# EAGLE design snowflake (EAGLE 7.4.0)
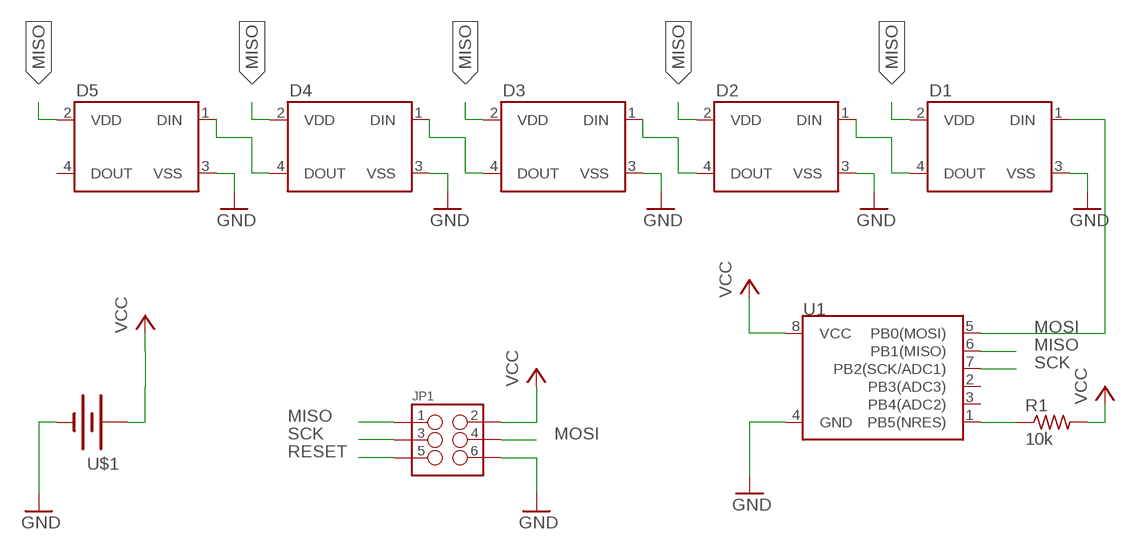
[diagram p0: schematic, sheet 1]

## Parts
D1  WS2812BEDGE_MOUNT_5MM_LED  [WS2812B]
D2  WS2812BEDGE_MOUNT_5MM_LED  [WS2812B]
D3  WS2812BEDGE_MOUNT_5MM_LED  [WS2812B]
D4  WS2812BEDGE_MOUNT_5MM_LED  [WS2812B]
D5  WS2812BEDGE_MOUNT_5MM_LED  [WS2812B]
JP1  M03X2POGO_PINS  [2X3_POGO]
R1  10k  R-US_R0805  [R0805]
U1  ATTINY45TINY85-20-SMT  [SO08-EIAJ]
U$1  BATTERY  [BHX2-2032-SM]

## Nets
GND: D1.3(VSS) D2.3(VSS) D3.3(VSS) D4.3(VSS) D5.3(VSS) JP1.P$6 U1.4(GND) U$1.GND(-)
MISO: D1.2(VDD) D2.2(VDD) D3.2(VDD) D4.2(VDD) D5.2(VDD) JP1.P$1 U1.6(PB1(MISO))
MOSI: D1.1(DIN) JP1.P$4 U1.5(PB0(MOSI))
N$2: D1.4(DOUT) D2.1(DIN)
N$3: D2.4(DOUT) D3.1(DIN)
N$4: D3.4(DOUT) D4.1(DIN)
N$5: D4.4(DOUT) D5.1(DIN)
RESET: JP1.P$5 R1.1 U1.1(PB5(NRES))
SCK: JP1.P$3 U1.7(PB2(SCK/ADC1))
VCC: JP1.P$2 R1.2 U1.8(VCC) U$1.VCC(+) U$1.VCC-2(+)
Unconnected: D5.4(DOUT) U1.2(PB3(ADC3)) U1.3(PB4(ADC2))

## Library data of the parts
D1-D5 = my-custom-lib:WS2812B: WS2812B - Intelligent control LED integrated light source Technical Specifications: Power Supply Voltage (VDD): 3.5 to 5.3 V Input Voltage (VI): -0.5 to VDD+0.5 V Operating Junction Temperature (Topt): -25°C to +80°C Storage Temperature Range (Tstg): -55°C to +150°C
JP1 = SparkFun-Connectors:M03X2: 2x3 .1" header. Shrouded, with keying- CONN-10681 SMT- CONN-11415 Pogo pins- HW-11044; PROD_ID: HW-11044
R1 = resistor:R-US_: RESISTOR, American symbol
U1 = SparkFun-DigitalIC:ATTINY45: Atmel 8-pin 2/4/8kB flash uC; PROD_ID: IC-09092; VALUE: Tiny85-20-SMT
U$1 = my-custom-lib:BATTERY: Battery Holders Various common sizes : AA, AAA, 18650 (PRT-12895), 20mm coin cell and 12mm coin cell. 20MM_4LEGS, BATT-10373

## Board
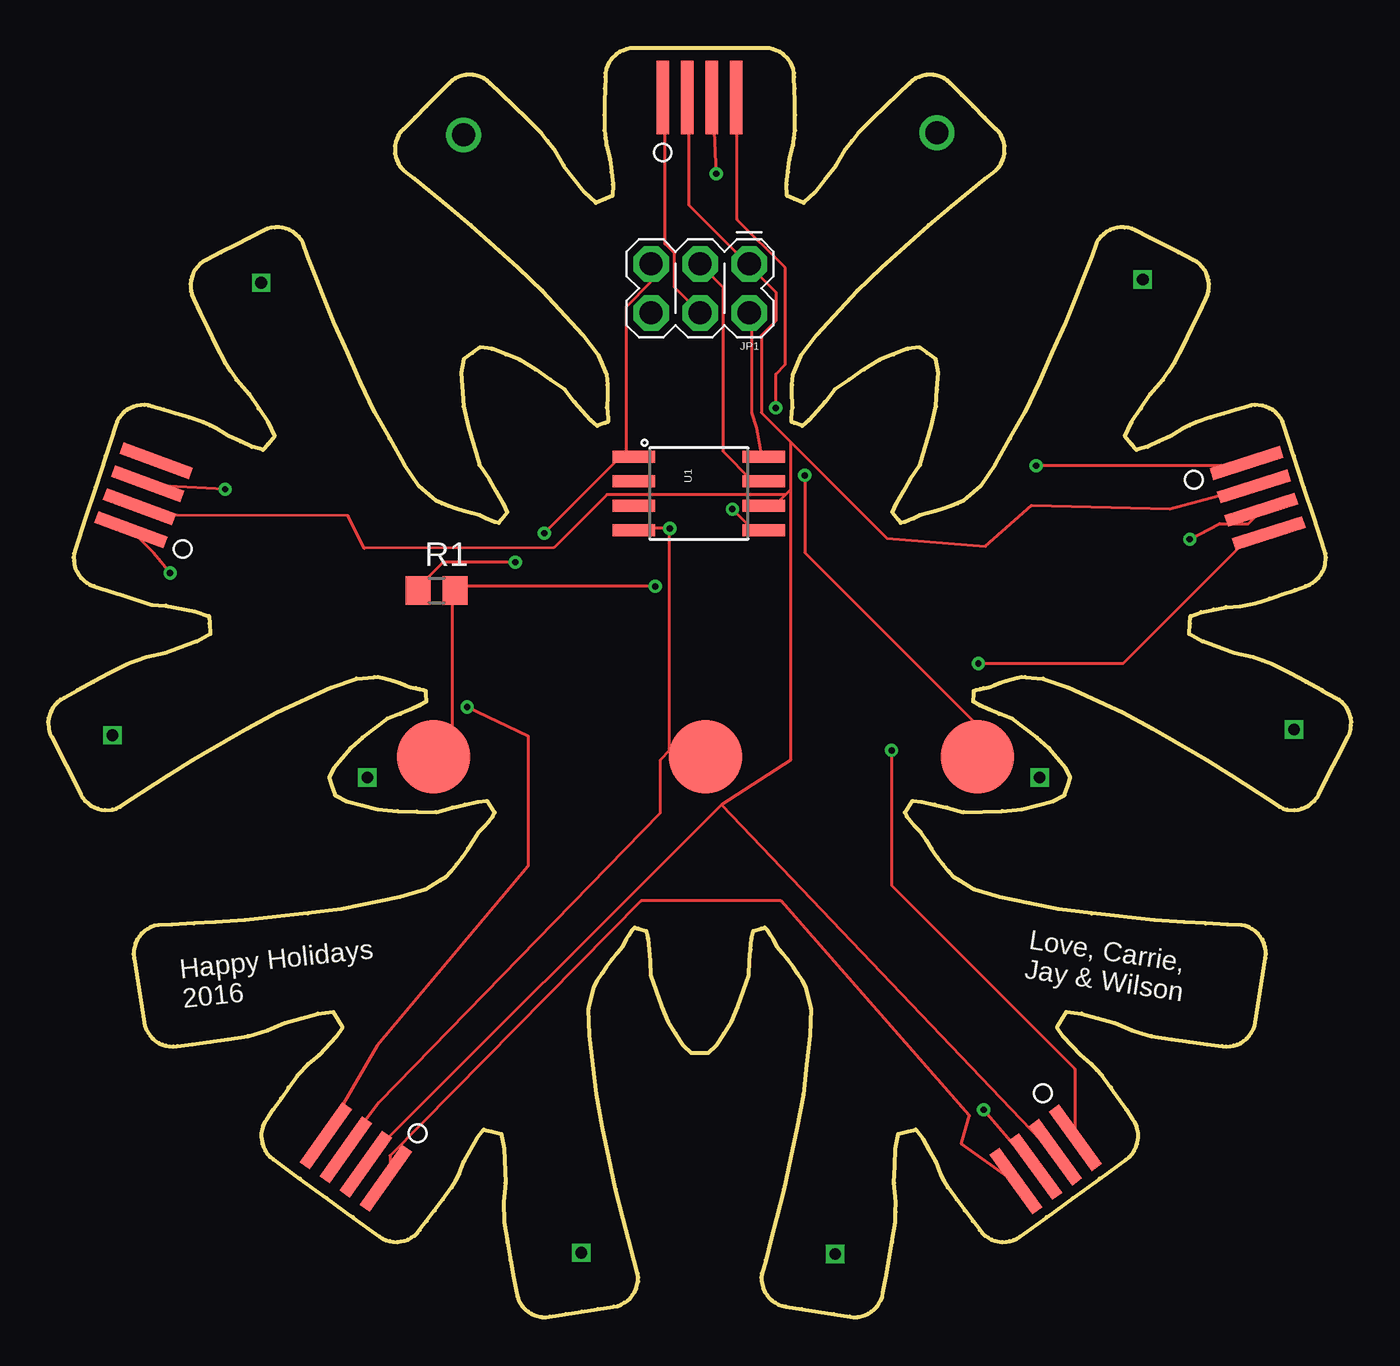
[diagram p1: board, top side]
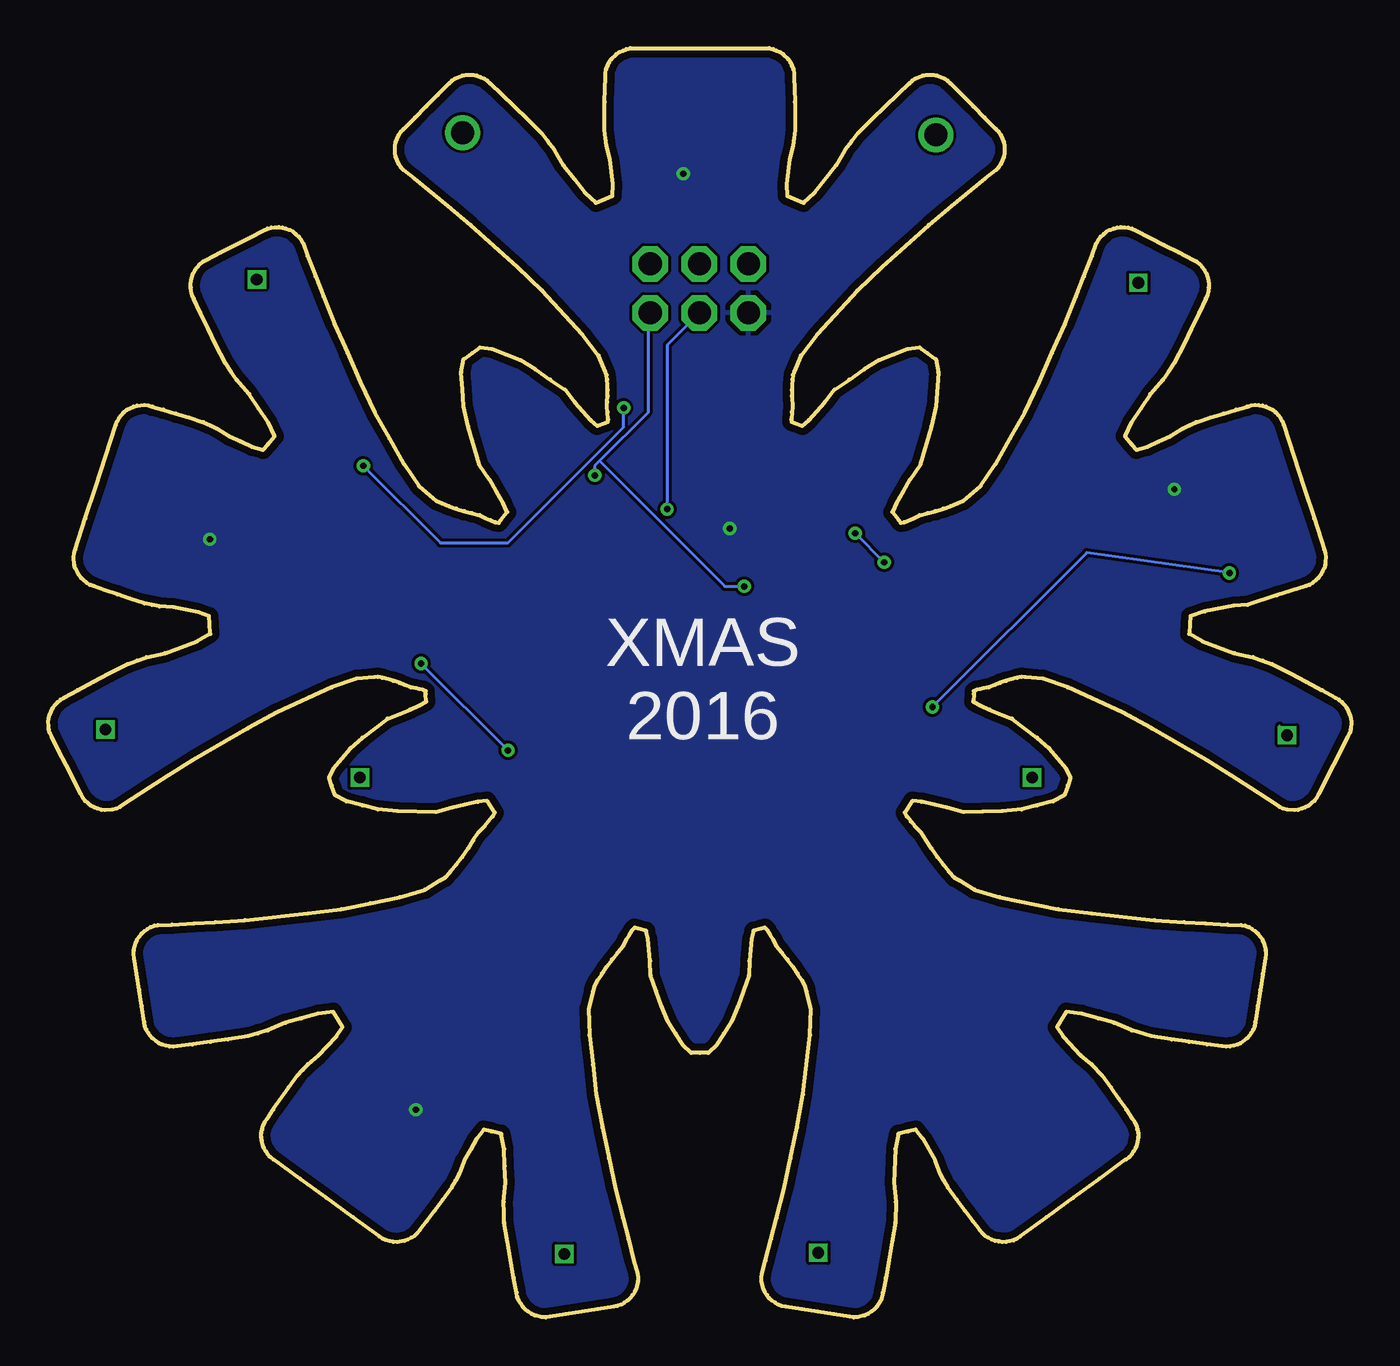
[diagram p2: board, bottom side, seen from below]

Size 67.54 x 65.76 mm. Coordinates in mm from the lower left corner, seen from the top.
Outline: 66.02,32.5 65.21,32.93 64.39,33.37 63.45,33.85 62.95,34.03 62.45,34.21 61.49,34.42 59.83,35.03 59.14,35.42 59.18,35.95 59.21,36.34 59.77,36.55 60.41,36.67 61.06,36.8 61.79,36.85 62.18,36.92 62.57,37 63.32,37.24 63.97,37.46 64.62,37.69 65.18,37.9 65.37,37.96 65.55,38.06 65.7,38.19 65.84,38.32 65.96,38.47 66.05,38.64 66.14,38.81 66.19,39 66.22,39.39 66.2,39.59 66.14,39.78 65.61,41.4 65.09,43.01 64.57,44.62 64.04,46.24 63.98,46.43 63.88,46.61 63.62,46.9 63.47,47.02 63.3,47.11 63.13,47.19 62.94,47.25 62.55,47.28 62.35,47.26 62.15,47.2 61.58,47.04 60.92,46.84 60.26,46.63 59.51,46.39 59.16,46.22 58.8,46.06 58.18,45.66 57.58,45.39 56.98,45.11 56.41,44.95 56.16,45.25 55.81,45.65 56.15,46.37 56.64,47.11 57.13,47.84 57.78,48.58 58.08,49.02 58.37,49.45 58.85,50.4 59.26,51.23 59.67,52.06 60,52.79 60.09,52.97 60.14,53.16 60.16,53.36 60.17,53.55 60.15,53.75 60.09,53.93 60.03,54.11 59.93,54.28 59.68,54.58 59.53,54.71 59.34,54.8 58.6,55.18 57.1,55.94 56.36,56.32 56.17,56.42 55.98,56.47 55.79,56.48 55.59,56.5 55.4,56.47 55.22,56.41 55.03,56.35 54.86,56.26 54.71,56.13 54.56,56.01 54.44,55.85 54.34,55.67 54.1,54.99 53.69,53.94 53.28,52.89 52.7,51.47 52.04,49.97 51.37,48.47 50.62,46.9 49.86,45.55 49.1,44.2 48.33,43.08 47.62,42.48 47.44,42.32 47.13,42.18 46.77,42.04 46.4,41.9 45.98,41.78 45.58,41.67 45.18,41.57 44.87,41.4 44.62,41.3 44.37,41.21 44.2,41.17 44.08,41.32 43.76,41.72 43.96,42.18 44.32,42.79 44.68,43.41 45.19,44.17 45.78,46.17 46.02,47.21 46.08,48.08 46.13,48.95 46,49.66 45.56,49.98 45.17,50.27 44.54,50.18 43.82,49.9 43.1,49.61 42.28,49.12 41.52,48.6 40.76,48.07 40.26,47.43 39.42,46.49 39.09,46.19 38.66,46.35 38.54,46.4 38.52,46.53 38.54,46.9 38.58,47.15 38.57,47.44 38.55,47.73 38.54,48.04 38.56,48.32 38.57,48.59 38.6,48.83 38.66,48.98 39.02,49.84 39.85,50.92 41.94,53.2 43.21,54.41 44.43,55.5 45.65,56.6 46.82,57.58 48.57,59.01 49.13,59.45 49.28,59.6 49.39,59.77 49.46,59.95 49.53,60.13 49.57,60.32 49.57,60.7 49.53,60.9 49.46,61.08 49.39,61.26 49.28,61.43 49.13,61.57 48.54,62.16 47.95,62.76 47.36,63.35 46.76,63.94 46.62,64.09 46.45,64.2 46.09,64.34 45.9,64.38 45.51,64.38 45.32,64.34 45.14,64.27 44.96,64.2 44.79,64.09 44.64,63.94 44.06,63.4 42.73,62.11 41.98,61.37 41.65,60.95 41.33,60.53 40.83,59.68 40.28,58.99 39.74,58.3 39.15,57.76 38.66,57.96 38.3,58.11 38.27,58.7 38.35,59.36 38.43,60.01 38.61,60.72 38.66,61.11 38.71,61.5 38.71,62.29 38.7,62.98 38.69,63.67 38.66,64.26 38.66,64.47 38.62,64.67 38.55,64.85 38.47,65.03 38.36,65.19 38.09,65.46 37.93,65.57 37.75,65.65 37.57,65.72 37.37,65.76 30.17,65.76 29.98,65.72 29.8,65.65 29.62,65.57 29.46,65.46 29.19,65.19 29.08,65.03 29,64.85 28.92,64.67 28.88,64.47 28.88,64.26 28.86,63.67 28.85,62.98 28.83,62.29 28.83,61.5 28.88,61.11 28.93,60.72 29.11,60.01 29.19,59.36 29.27,58.7 29.25,58.11 28.88,57.96 28.39,57.76 27.81,58.3 26.72,59.68 26.22,60.53 25.89,60.95 25.57,61.37 24.82,62.11 23.49,63.4 22.9,63.94 22.75,64.09 22.59,64.2 22.23,64.34 22.03,64.38 21.65,64.38 21.46,64.34 21.1,64.2 20.93,64.09 20.78,63.94 19.6,62.76 19.01,62.16 18.41,61.57 18.27,61.43 18.16,61.26 18.01,60.9 17.97,60.7 17.97,60.32 18.01,60.13 18.08,59.95 18.16,59.77 18.27,59.6 18.41,59.45 18.98,59.01 20.72,57.58 21.9,56.6 23.12,55.5 24.34,54.41 25.6,53.2 27.7,50.92 28.53,49.84 28.88,48.98 28.95,48.83 28.98,48.59 28.99,48.32 29,48.04 28.99,47.73 28.96,47.15 29,46.9 29.03,46.53 29.01,46.4 28.88,46.35 28.46,46.19 28.12,46.49 27.29,47.43 26.79,48.07 26.02,48.6 25.26,49.12 24.45,49.61 23.73,49.9 23.01,50.18 22.38,50.27 21.98,49.98 21.54,49.66 21.41,48.95 21.52,47.21 21.76,46.17 22.36,44.17 22.87,43.41 23.23,42.79 23.58,42.18 23.79,41.72 23.47,41.32 23.35,41.17 23.17,41.21 22.68,41.4 22.36,41.57 21.96,41.67 21.56,41.78 21.14,41.9 20.78,42.04 20.41,42.18 20.1,42.32 19.92,42.48 19.22,43.08 18.45,44.2 17.69,45.55 16.92,46.9 16.17,48.47 15.51,49.97 14.84,51.47 14.27,52.89 13.86,53.94 13.45,54.99 13.2,55.67 13.11,55.85 12.98,56.01 12.83,56.13 12.68,56.26 12.51,56.35 12.33,56.41 12.15,56.47 11.95,56.5 11.76,56.48 11.57,56.47 11.37,56.42 11.19,56.32 10.44,55.94 9.69,55.56 8.95,55.18 8.2,54.8 8.02,54.71 7.86,54.58 7.74,54.43 7.61,54.28 7.52,54.11 7.46,53.93 7.4,53.75 7.37,53.55 7.39,53.36 7.4,53.16 7.45,52.97 7.55,52.79 7.88,52.06 8.28,51.23 8.69,50.4 9.17,49.45 9.47,49.02 9.76,48.58 10.42,47.84 10.91,47.11 11.4,46.37 11.73,45.65 11.39,45.25 11.13,44.95 10.56,45.11 9.96,45.39 9.37,45.66 8.75,46.06 8.39,46.22 8.03,46.39 7.28,46.63 6.62,46.84 5.96,47.04 5.39,47.2 5.19,47.26 4.99,47.28 4.8,47.27 4.61,47.25 4.42,47.19 4.08,47.02 3.92,46.9 3.8,46.75 3.67,46.61 3.57,46.43 3.5,46.24 2.98,44.62 2.45,43.01 1.93,41.4 1.41,39.78 1.34,39.59 1.32,39.39 1.34,39.19 1.36,39 1.41,38.81 1.5,38.64 1.58,38.47 1.7,38.32 1.85,38.19 2,38.06 2.17,37.96 2.37,37.9 3.87,37.41 5.37,36.92 6.1,36.87 7.58,36.58 8.33,36.34 8.37,35.95 8.41,35.42 7.71,35.03 6.06,34.42 5.09,34.21 4.6,34.03 4.1,33.85 3.16,33.37 2.34,32.93 1.52,32.5 0.83,32.11 0.64,32.01 0.49,31.89 0.36,31.74 0.24,31.59 0.14,31.42 0.08,31.24 0.02,31.05 0,30.86 0.03,30.47 0.08,30.28 0.17,30.09 0.93,28.6 1.31,27.85 1.69,27.11 1.79,26.92 1.92,26.77 2.06,26.64 2.21,26.52 2.38,26.42 2.57,26.36 2.75,26.3 2.94,26.28 3.33,26.31 3.53,26.36 3.71,26.45 4.3,26.85 5.25,27.46 6.2,28.07 7.5,28.88 10.34,30.53 11.87,31.36 14.69,32.64 15.98,33.1 16.9,33.17 17.08,33.19 17.33,33.14 17.9,32.98 18.21,32.87 18.5,32.76 18.79,32.65 19.05,32.61 19.25,32.56 19.44,32.51 19.56,32.45 19.57,32.31 19.59,31.91 19.25,31.71 18.75,31.49 18.25,31.27 17.58,31.03 16.3,30.05 15.67,29.5 15.24,28.98 14.81,28.46 14.57,27.96 14.7,27.56 14.86,27.06 15.46,26.73 16.27,26.53 17.08,26.32 18.1,26.23 19.1,26.2 20.1,26.18 20.94,26.42 21.61,26.56 22.27,26.71 22.75,26.76 23.02,26.35 23.15,26.15 23.04,25.96 22.83,25.71 22.62,25.45 22.31,25.15 22.04,24.72 21.76,24.29 21.45,23.85 21.16,23.47 20.86,23.1 20.57,22.79 20.32,22.64 19.53,22.16 18.23,21.77 15.19,21.16 13.46,20.93 10.2,20.59 8.67,20.48 7.54,20.42 6.42,20.35 5.7,20.33 5.5,20.29 5.31,20.22 5.14,20.12 4.98,20.02 4.84,19.88 4.72,19.73 4.61,19.57 4.53,19.4 4.43,19.02 4.42,18.82 4.46,18.61 4.59,17.78 4.72,16.96 4.85,16.13 4.98,15.3 5.01,15.1 5.08,14.91 5.19,14.75 5.29,14.58 5.42,14.44 5.73,14.21 5.91,14.13 6.1,14.08 6.29,14.04 6.49,14.03 6.69,14.06 7.48,14.15 8.4,14.28 9.32,14.41 10.36,14.57 11.38,14.87 12.28,15.26 13.13,15.5 13.98,15.74 14.77,15.83 15.05,15.38 15.25,15.05 14.93,14.55 14.03,13.59 13.46,13.12 12.93,12.54 12.46,11.91 12.07,11.34 11.67,10.77 11.34,10.28 11.22,10.11 11.14,9.93 11.09,9.74 11.05,9.55 11.04,9.35 11.1,8.98 11.17,8.79 11.27,8.63 11.37,8.46 11.51,8.31 11.67,8.19 13.05,7.19 14.42,6.19 15.79,5.2 17.16,4.2 17.33,4.08 17.51,4 17.7,3.95 17.89,3.91 18.09,3.9 18.28,3.93 18.47,3.96 18.65,4.03 18.82,4.13 18.98,4.23 19.13,4.36 19.25,4.53 19.62,5 20.04,5.55 20.45,6.1 20.92,6.74 21.11,7.08 21.3,7.43 21.57,8.11 22.21,9.26 22.58,9.72 22.96,9.63 23.47,9.51 23.63,8.73 23.7,6.97 23.61,5.98 23.64,4.93 23.8,3.88 23.97,2.97 24.13,2.06 24.28,1.28 24.32,1.07 24.39,0.89 24.59,0.56 24.73,0.41 24.88,0.3 25.04,0.19 25.21,0.1 25.59,0.01 25.79,0 26,0.03 26.83,0.16 27.65,0.29 28.48,0.43 29.31,0.56 29.51,0.59 29.7,0.66 29.86,0.76 30.03,0.87 30.17,1 30.28,1.16 30.4,1.31 30.48,1.49 30.57,1.87 30.58,2.07 30.55,2.27 30.35,2.96 30.07,4.05 29.78,5.14 29.41,6.63 29.07,8.23 28.73,9.84 28.41,11.55 28.06,14.63 28.02,15.99 28.24,16.89 28.29,17.14 28.47,17.46 28.7,17.81 28.94,18.16 29.22,18.54 29.5,18.88 29.78,19.23 29.96,19.57 30.11,19.81 30.26,20.05 30.39,20.2 30.59,20.14 31,20.03 31.08,19.63 31.2,18.47 31.23,17.72 31.8,16.11 32.14,15.31 32.52,14.71 32.9,14.1 33.32,13.7 33.77,13.7 34.22,13.7 34.64,14.1 35.03,14.71 35.41,15.31 35.75,16.12 36.04,16.92 36.32,17.73 36.35,18.47 36.4,19.05 36.46,19.63 36.55,20.03 36.95,20.14 37.15,20.2 37.28,20.05 37.44,19.81 37.59,19.57 37.76,19.23 38.04,18.88 38.32,18.54 38.61,18.16 38.84,17.81 39.07,17.46 39.25,17.14 39.31,16.89 39.53,15.99 39.49,14.63 39.31,13.09 39.14,11.55 38.82,9.84 38.48,8.23 38.13,6.63 37.76,5.14 37.48,4.05 37.19,2.96 36.99,2.27 36.96,2.07 36.97,1.87 37.07,1.49 37.15,1.31 37.26,1.16 37.37,1 37.52,0.87 37.68,0.76 37.85,0.66 38.04,0.59 38.24,0.56 39.07,0.43 40.72,0.16 41.55,0.03 41.75,0 41.95,0.01 42.33,0.1 42.51,0.19 42.66,0.3 42.82,0.41 42.95,0.56 43.05,0.72 43.16,0.89 43.23,1.07 43.26,1.28 43.42,2.06 43.74,3.88 43.91,4.93 43.92,5.46 43.94,5.98 43.85,6.97 43.88,7.85 43.91,8.73 44.07,9.51 44.59,9.63 44.97,9.72 45.34,9.26 45.66,8.69 45.98,8.11 46.25,7.43 46.44,7.08 46.63,6.74 47.09,6.1 47.51,5.55 47.92,5 48.29,4.53 48.41,4.36 48.56,4.23 48.73,4.13 48.9,4.03 49.08,3.96 49.46,3.9 49.65,3.91 49.84,3.95 50.03,4 50.22,4.08 50.38,4.2 51.76,5.2 53.13,6.19 54.5,7.19 55.87,8.19 56.04,8.31 56.18,8.46 56.28,8.63 56.38,8.79 56.44,8.98 56.47,9.17 56.5,9.35 56.5,9.55 56.45,9.74 56.41,9.93 56.33,10.11 56.2,10.28 55.88,10.77 55.08,11.91 54.62,12.54 54.35,12.83 54.08,13.12 53.52,13.59 53.07,14.07 52.62,14.55 52.29,15.05 52.5,15.38 52.77,15.83 53.56,15.74 54.41,15.5 55.26,15.26 56.17,14.87 56.68,14.72 57.18,14.57 58.23,14.41 59.14,14.28 60.06,14.15 60.85,14.06 61.06,14.03 61.26,14.04 61.45,14.08 61.64,14.13 61.81,14.21 61.97,14.33 62.12,14.44 62.26,14.58 62.36,14.75 62.46,14.91 62.53,15.1 62.57,15.3 62.7,16.13 62.83,16.96 63.09,18.61 63.12,18.82 63.11,19.02 63.07,19.21 63.02,19.4 62.94,19.57 62.82,19.73 62.71,19.88 62.57,20.02 62.4,20.12 62.24,20.22 62.05,20.29 61.85,20.33 61.13,20.35 60,20.42 58.88,20.48 57.35,20.59 54.09,20.93 52.36,21.16 50.84,21.46 49.32,21.77 48.01,22.16 47.22,22.64 46.98,22.79 46.69,23.1 46.39,23.47 46.09,23.85 45.79,24.29 45.51,24.72 45.23,25.15 44.92,25.45 44.51,25.96 44.4,26.15 44.53,26.35 44.8,26.76 45.28,26.71 45.94,26.56 46.6,26.42 47.45,26.18 49.44,26.23 50.46,26.32 51.27,26.53 52.08,26.73 52.68,27.06 52.85,27.56 52.98,27.96 52.74,28.46 52.31,28.98 51.87,29.5 51.25,30.05 49.97,31.03 49.3,31.27 48.8,31.49 48.29,31.71 47.96,31.91 47.97,32.31 47.98,32.45 48.1,32.51 48.3,32.56 48.49,32.61 48.76,32.65 49.05,32.76 49.34,32.87 49.65,32.98 50.22,33.14 50.47,33.19 50.64,33.17 51.57,33.1 52.85,32.64 55.67,31.36 57.21,30.53 60.04,28.88 61.34,28.07 62.29,27.46 63.24,26.85 63.84,26.45 64.02,26.36 64.21,26.31 64.6,26.28 64.8,26.3 64.98,26.36 65.16,26.42 65.33,26.52 65.48,26.64 65.63,26.77 65.76,26.92 65.85,27.11 66.23,27.85 66.61,28.6 66.99,29.35 67.37,30.09 67.47,30.28 67.52,30.47 67.53,30.67 67.55,30.86 67.52,31.05 67.46,31.24 67.4,31.42 67.31,31.59 67.18,31.74 67.06,31.89 66.9,32.01 66.72,32.11
Outline: 65.99,32.51 66.77,32.08
Copper layers (1*16): Top 0.0356mm / dielectric 1.5011mm / Bottom 0.0356mm
Design rules "oshpark-2layer": minimum track width 6mil, minimum drill 13mil, track to track 6mil, track to pad 6mil, pad to pad 6mil, via to via 6mil, smd to smd 6mil, copper to edge 15mil, drill to drill 6mil, minimum pad ring 7mil, minimum via ring 7mil, stop-mask expansion 2.5mil, vias tented up to drill 0mil, thermal gap 10mil

### Footprints (pad centres in the part's own frame; a part is rotated, then mirrored left to right if it is on the bottom)
WS2812B = smd 3.81 x 0.635: 1 0,-1.905; 2 0,-0.635; 3 0,0.635; 4 0,1.905
2X3_POGO = drill 1.2 pad 1.829 octagon: P$1 0,0; P$2 0,2.54; P$3 2.54,0; P$4 2.54,2.54; P$5 5.08,0; P$6 5.08,2.54
R0805 = smd 1.3 x 1.5: 1 -0.95,0; 2 0.95,0
SO08-EIAJ = smd 0.61 x 2.21: 1 -1.905,-3.378; 2 -0.635,-3.378; 3 0.635,-3.378; 4 1.905,-3.378; 5 1.905,3.353; 6 0.635,3.353; 7 -0.635,3.353; 8 -1.905,3.353
BHX2-2032-SM = smd 3.81 x 3.81: GND 0,0; VCC -14.1,0; VCC-2 14.1,0

### Placement (x,y rotation side)
D1  33.76,63.22 270 top
D2  62.69,42.46 197.7 top
D3  51.7,8.18 126 top
D4  15.94,8.31 54.6 top
D5  4.94,42.59 339.8 top
JP1  36.33,54.59 180 top
R1  20.13,37.67 0 top
U1  33.73,42.69 270 top
U$1  34.07,29.04 0 top

### Tracks (layer width: path | path; a pad name or v marks a point on that pad's centre or on a via)
GND  (via drill 0.33)
  Top 0.152: 31.96,40.88 30.46,40.88 U1.4 | 31.96,40.88 32.21,40.63 32.21,29.38 | 32.21,29.38 32.46,29.13 33.96,29.13 U$1.GND 32.21,29.38 | 32.21,29.38 31.71,28.88 31.71,26.13 17.13,11.12 15.46,8.88 D4.3 | v9.17,42.91 5.21,43.13 D5.3 | v48.49,10.76 50.96,7.88 D3.3 | v34.63,59.26 34.46,63.13 D1.3 | v59.17,40.32 60.71,41.13 62.21,41.13 62.71,41.63 D2.3 | v32.21,40.88 31.96,40.88
  pour Bottom: 3.25,47.7 -0.56,36.27 -0.24,29.86 2.3,24.78 4.52,17.22 4.52,13.41 9.6,8.33 18.49,1.98 24.84,-0.56 42.62,-0.56 50.24,3.25 62.94,13.41 64.21,24.84 65.48,26.11 68.02,29.92 66.75,38.81 64.21,48.97 60.4,54.05 56.35,57.1 45.16,65.48 33.42,66.05 23.57,65.48 18.49,62.94 8.33,55.32
MISO
  Top 0.152: 38.46,42.88 38.21,42.63 | 38.21,42.63 37.71,42.13 37.21,42.13 U1.6 | 38.46,45.38 38.46,42.88 | 38.46,45.38 36.96,46.88 36.96,50.88 37.71,51.63 37.71,53.13 36.46,54.38 JP1.P$1 36.21,54.63 33.21,57.63 33.21,63.13 D1.2 | 38.21,42.63 28.96,42.63 26.21,39.88 16.38,39.84 15.56,41.53 6.14,41.57 D5.2 | 34.89,26.55 38.46,28.86 38.46,42.88 | 34.89,26.55 16.46,8.13 D4.2 | 34.89,26.55 51.96,8.63 D3.2 | 38.46,45.38 43.46,40.38 48.58,39.96 50.99,42.08 58.13,41.89 D2.2
MOSI  (via drill 0.33)
  Top 0.152: v35.46,41.88 36.46,40.88 36.96,40.88 U1.5 | D1.1 31.96,63.13 31.96,55.63 32.46,55.13 32.46,53.38 33.71,52.13 JP1.P$4
  Bottom 0.152: v35.46,41.88 35.46,50.38 33.96,51.88 JP1.P$4
N$1  (via drill 0.6)
  Bottom 0.152: 51.21,28.13 v51.4,27.96
N$2  (via drill 0.33)
  Top 0.152: v37.71,47.13 37.71,48.88 38.21,49.38 38.21,54.38 35.71,56.88 35.71,63.13 D1.4 | v51.21,44.13 61.96,44.13 D2.1
  Bottom 0.152: v37.71,47.13 37.71,46.13 43.71,40.13 47.21,40.13 v51.21,44.13
N$3  (via drill 0.33)
  Top 0.152: v43.71,29.38 43.71,22.38 53.21,12.88 53.21,9.38 D3.1 | v48.21,33.88 55.71,33.88 62.46,40.63 63.21,40.63 D2.4
  Bottom 0.152: v48.21,33.88 v43.71,29.38
N$4
  Top 0.152: D4.1 17.71,7.38 17.71,8.38 30.73,21.59 37.98,21.59 47.76,10.45 47.33,9.01 49.96,7.13 D3.4
N$5  (via drill 0.33)
  Top 0.152: v21.71,31.63 24.88,30.13 24.88,23.38 17.05,14.08 14.46,9.63 D4.4 | v6.32,38.57 5.46,39.63 4.46,40.63 D5.1
  Bottom 0.152: v21.71,31.63 13.71,39.63 v6.32,38.57
N$6  (via drill 0.6)
  other vias: 27.62,3.35
N$7  (via drill 0.6)
  other vias: 40.79,3.29
N$8  (via drill 0.6)
  other vias: 64.57,30.45
N$9  (via drill 0.6)
  other vias: 56.74,53.78
N$10  (via drill 1.2)
  other vias: 46.07,61.39
N$11  (via drill 1.2)
  other vias: 21.53,61.27
N$12  (via drill 0.6)
  other vias: 11.04,53.61
N$13  (via drill 0.6)
  Bottom 0.152: 3.71,30.63 v3.32,30.16
N$14  (via drill 0.6)
  Bottom 0.152: 16.71,27.63 v16.55,27.98
RESET  (via drill 0.33)
  Top 0.152: v24.21,39.13 20.46,39.13 19.21,37.88 R1.1 | v25.71,40.63 29.46,44.38 29.96,44.38 | 29.96,44.38 30.21,44.38 U1.1 29.96,44.38 | 29.96,44.38 29.96,52.38 31.21,53.63 31.21,54.38 JP1.P$5
  Bottom 0.152: v25.71,40.63 v24.21,39.13
SCK
  Top 0.152: U1.7 36.96,43.38 36.46,43.38 34.96,44.88 34.96,53.38 33.96,54.38 JP1.P$3
VCC  (via drill 0.33)
  Top 0.152: U$1.VCC 20.21,29.13 20.96,29.88 20.96,37.63 R1.2 21.21,37.88 v31.46,37.88 | U1.8 36.96,44.63 36.72,46.06 36.46,46.88 36.46,51.88 JP1.P$2 | v39.21,43.63 39.21,39.63 47.96,30.88 47.96,29.13 U$1.VCC-2
  Bottom 0.152: v39.21,43.63 39.21,44.13 38.96,44.38 | 38.96,44.38 36.46,46.88 36.46,51.88 JP1.P$2 | v31.46,37.88 32.46,37.88 38.96,44.38

### Text on the board
tNames: Love, Carrie, / Jay & Wilson | Happy Holidays / 2016
bNames: XMAS / 2016